# Altium schematic sheet Compute.SchDoc
size A4; SheetNumber: 4; SheetTotal: 4
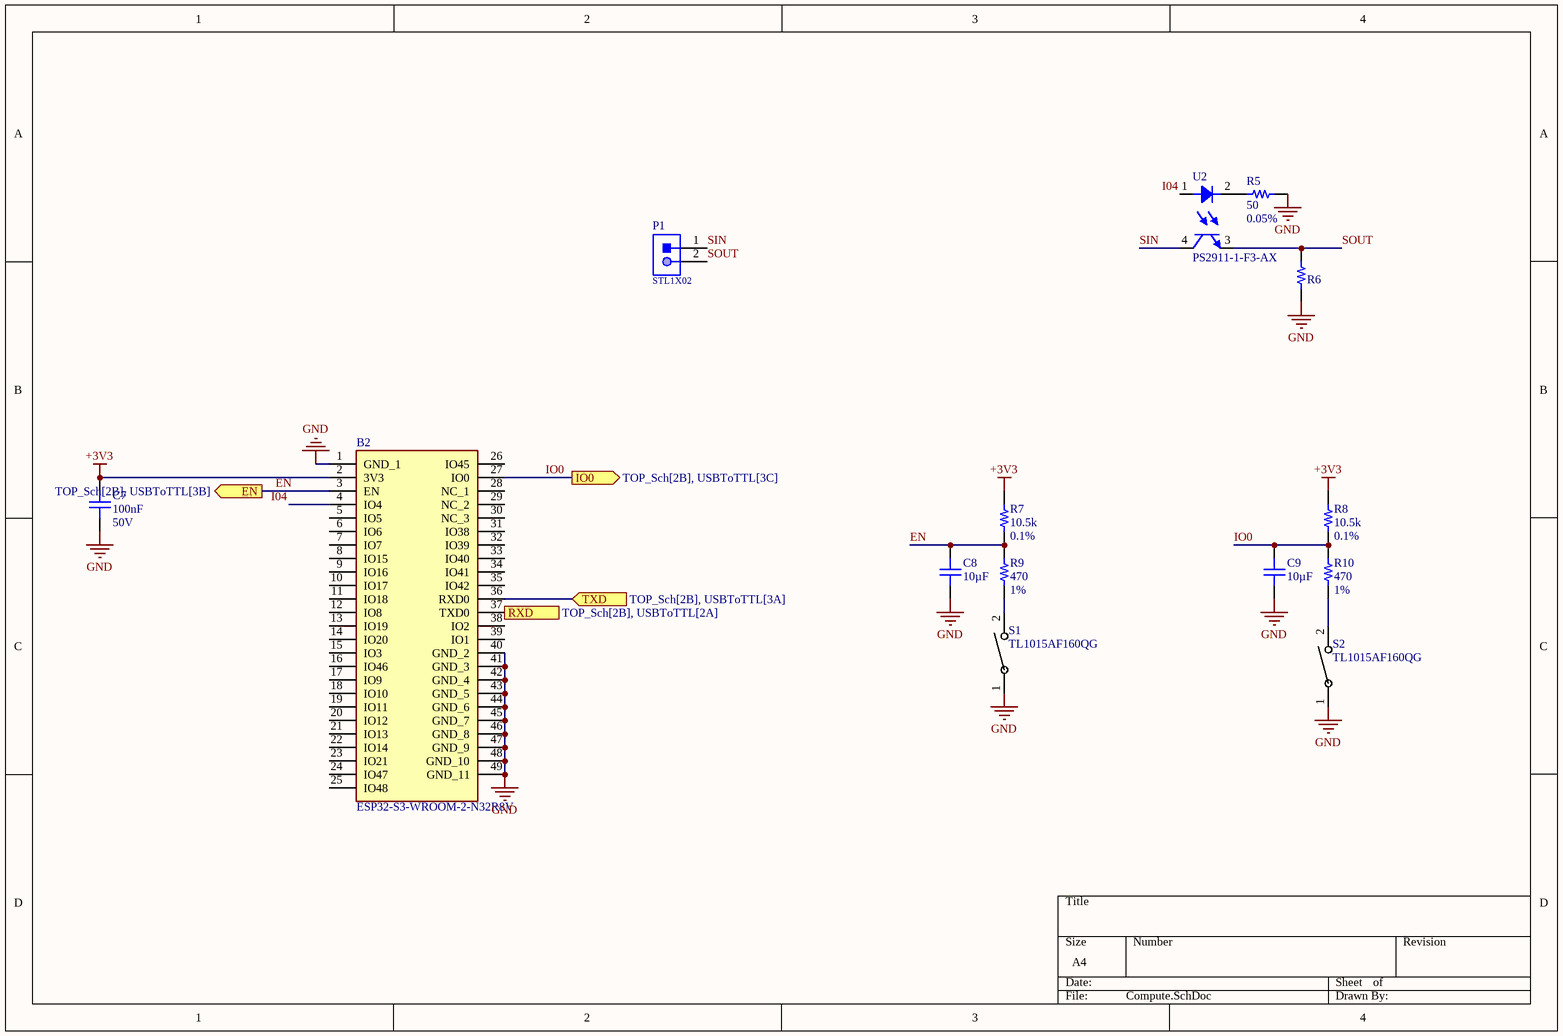
[diagram p0: Compute.SchDoc]

## Parts
B2  ESP32-S3-WROOM-2-N32R8V  [ESP32S3WROOM2N32R8V]
C7  value 100nF  Voltage Rating: 50V  [CAPC1608X90X35LL15T15]  (hidden comment: 06035C104KAT4A)
C8  value 10µF  [FP-GRM188-0_2-IPC_B]  (hidden comment: GRM188R61E106MA73J)
C9  value 10µF  [FP-GRM188-0_2-IPC_B]  (hidden comment: GRM188R61E106MA73J)
P1  STL1X02  [TSW-102-07-XXX-S]
R5  value 50  Tolerance: 0.05%  [FP-RG1608-MFG]  (hidden comment: RC-5kOhm)
R6  CR0603-JW-101ELF  [FP-CR0603-IPC_A]  (value not drawn)
R7  value 10.5k  Tolerance: 0.1%  [RESC1608X06N 0603 Medium Density]  (hidden comment: RG1608P-1052-B-T5)
R8  value 10.5k  Tolerance: 0.1%  [RESC1608X06N 0603 Medium Density]  (hidden comment: RG1608P-1052-B-T5)
R9  value 470  Tolerance: 1%  [RESC1608X06N 0603 Medium Density]  (hidden comment: RC0603FR-07470RL)
R10  value 470  Tolerance: 1%  [RESC1608X06N 0603 Medium Density]  (hidden comment: RC0603FR-07470RL)
S1  TL1015AF160QG  [SW_F160QG_EWI]
S2  TL1015AF160QG  [SW_F160QG_EWI]
U2  PS2911-1-F3-AX  [PS2911-1-F3-AX-Footprint-1]

## Ports
EN (out, see TOP_Sch[2B], USBToTTL[3B]), IO0 (out, see TOP_Sch[2B], USBToTTL[3C]), RXD (out, see TOP_Sch[2B], USBToTTL[2A]), TXD (in, see TOP_Sch[2B], USBToTTL[3A])

## Nets
+3V3: B2.2(3V3) C7.2 R7.2 R8.2
GND: B2.1(GND_1) B2.40(GND_2) B2.41(GND_3) B2.42(GND_4) B2.43(GND_5) B2.44(GND_6) B2.45(GND_7) B2.46(GND_8) B2.47(GND_9) B2.48(GND_10) B2.49(GND_11) C7.1 C8.1 C9.1 R5.2 R6.1 S1.1 S2.1
EN: B2.3(EN) C8.2 R7.1 R9.2 ; port EN
I04: B2.4(IO4) U2.1
IO0: B2.27(IO0) C9.2 R8.1 R10.2 ; port IO0
RXD: B2.37(TXD0) ; port RXD
SIN: P1.1 U2.4
SOUT: P1.2 R6.2 U2.3
TXD: B2.36(RXD0) ; port TXD
NetR5_1: R5.1 U2.2
NetR9_1: R9.1 S1.2
NetR10_1: R10.1 S2.2

Not connected (* = marked no-connect by the designer): B2 5(IO5) 6(IO6) 7(IO7) 8(IO15) 9(IO16) 10(IO17) 11(IO18) 12(IO8) 13(IO19) 14(IO20) 15(IO3) 16(IO46) 17(IO9) 18(IO10) 19(IO11) 20(IO12) 21(IO13) 22(IO14) 23(IO21) 24(IO47) 25(IO48) 26(IO45) 28(NC_1) 29(NC_2) 30(NC_3) 31(IO38) 32(IO39) 33(IO40) 34(IO41) 35(IO42) 38(IO2) 39(IO1)

## Library data of the parts
B2 = ESP32-S3-WROOM-2-N32R8V: WiFi Modules - 802.11 [ENGINEERING SAMPLES] SMD Module, ESP32-S3R8 with 1.8V 8 MB Octal PSRAM, 32 MB Octal SPI Flash, PCB Antenna; Manufacturer_Name: Espressif Systems; Geometry.Height: 3.25mm; Mouser Part Number: 356-ESP3S3WRM2N32R8V; Mouser Price/Stock: https://www.mouser.co.uk/ProductDetail/Espressif-Systems/ESP32-S3-WROOM-2-N32R8V?qs=Li%252BoUPsLEntC3FaT%2FvCeug%3D%3D; Manufacturer_Part_Number: ESP32-S3-WROOM-2-N32R8V; Datasheet Link: https://www.espressif.com/sites/default/files/documentation/esp32-s3-wroom-2_datasheet_en.pdf
C7 = CMP-001-00048-2: Ceramic Capacitor, Multilayer, Ceramic, 50V, 10% +Tol, 10% -Tol, X7R, 15% TC, 0.1uF, Surface Mount, 0603; Multilayer: Yes; Capacitance: 100 nF; Temperature Characteristics Code: X7R; Length: 1.6mm; Height: 0.9mm; Packaging: Tape and Reel; Tolerance: 10%; Mounting Technology: Surface Mount; Rated DC Voltage (URdc): 50V; Package Style: SMTMeter; Tolerance (fill in as +-): 10%; RoHS Compliant: Yes; Min Operating Temperature: -55°C; Capacitor Type: Ceramic; JESD-609 Code: e3; Terminal Finish: Nickel; Max Operating Temperature: 125°C; Pins: 2; Tolerance  (fill in as +-): 10%; Width: 0.81mm; Termination: Wraparound; Reach SVHC Compliant: Yes; Dielectric Material: Ceramic; Package Shape: Rectangular; Case/Package: 0603
C8 C9 = CMP-001-00049-1: Ceramic Capacitor, Multilayer, Ceramic, 25V, 20% +Tol, 20% -Tol, X5R, 15% TC, 10uF, Surface Mount, 0603; Multilayer: Yes; Height: 0.8mm; JESD-609 Code: e3; Rated DC Voltage (URdc): 25V; RoHS Compliant: Yes; Pins: 2; Tolerance (fill in as +-): 20%; Temperature Characteristics Code: X5R; Length: 1.6mm; Case/Package: 0603; Mounting Technology: Surface Mount; Termination: Wraparound; Package Shape: Rectangular; Reach SVHC Compliant: Yes; Dielectric Material: Ceramic; Terminal Finish: Nickel; Max Operating Temperature: 85°C; Capacitor Type: Ceramic; Packaging: Tape and Reel; Min Operating Temperature: -55°C; Package Style: SMTMeter; Tolerance  (fill in as +-): 20%; Width: 0.8mm
P1 = CMP-061-000008-4: Stiftleiste, 2-Pin; Pin Count: 2; Source: Pin_Header.SchLib; Design Item ID: STL1X02; Component Type: Standard
R5 = CMP-009-00170-1: RES SMD 5 kOHM 0.05% 1/10W 0603; Voltage Rating: 75V; Resistance: 680R; Power Rating: 62.5mW; Working Voltage: 100V; Temperature Coefficient: 10ppm/°C; Max Power Dissipation: 100mW; Packaging: Tape and Reel; Series: RG; Height: 0.02inch; Case Code (Imperial): 0603; Technology: THIN FILM; Weight: 7.1E-05oz; Construction: Rectangular; Termination: SMD/SMT; Military Standard: Not; Number of Terminations: 2; Voltage Rating (DC): 75V; Package Quantity: 1; Case Code (Metric): 1608; Lead Free: Lead Free; Resistor Type: Thin Film; Features: Automotive AEC-Q200; Length: 0.063inch; Width: 0.031inch; Max Operating Temperature: 155°C; Depth: 0.8mm; Min Operating Temperature: -55°C; RoHS Compliant: Yes; Case/Package: 0603
R6 = CMP-009-00203-1: Fixed Resistor, Metal Glaze/thick Film, 0.1W, 100ohm, 75V, 5% +/-Tol, 200ppm/Cel, Surface Mount, 0603; Power: 100mW; Value: 100; Tolerance: 5%; Min Operating Temperature: -55°C; Max Operating Temperature: 155°C; Pins: 2; JLCPCB Part #: C913237; RoHS Compliant: Yes; Mounting Technology: Surface Mount; Case/Package: 0603
R7 R8 = CMP-009-00046-3: TR / Thin Film Chip Resistors 0603 size, 1/10W, 10.5K ohm, 0.1%, 25ppm; Temperature Coefficient: 25ppm/°C; Resistance: 10.5kR; Max Power Dissipation: 100mW; Voltage Rating (DC): 75V; Voltage Rating: 100V; Packaging: Tape and Reel; Case Code (Imperial): 0603; Case Code (Metric): 1608; Case/Package: 0603; Termination: SMD/SMT; Height: 0.4mm; RoHS Compliant: Yes; Resistor Type: Thin Film; Max Operating Temperature: 155°C; Width: 0.8mm; Features: Automotive AEC-Q200,Anti-Sulfur; Weight: 7.1E-05oz; Length: 1.6mm; Power Rating: 100mW; Min Operating Temperature: -55°C; Lead Free: Lead Free; Number of Terminations: 2; Series: RG
R9 R10 = CMP-009-00156-1: Res Thick Film 0603 470 Ohm 1% 0.1W(1/10W) ±100ppm/C Pad SMD T/R; Voltage Rating: 50V; Power: 100mW; Temperature Coefficient: 100ppm/°C; Min Operating Temperature: -55°C; Depth: 0.8mm; Max Operating Temperature: 155°C; Length: 0.063inch; Pins: 2; Case/Package: 0603; Mounting Technology: Surface Mount; Height: 0.022inch; RoHS Compliant: Yes
S1 S2 = TL1015AF160QG: No Description Available; Mfr_Name: E-Switch
U2 = CMP-00026-00000-3: RENESAS - PS2911-1-F3-AX - OPTOKOPPLER,TR O/P,USOP-4